# Altium schematic sheet External SDRAM.SchDoc: Ornihopter Kamera Kartı
size A4; CompanyName: Erü EEM; Engineer: Berat Bayram; Address1: https://www.linkedin.com/in/beratbayram-eee/; DocumentNumber: OKK_1; Revision: V1; SheetNumber: 2; SheetTotal: 5
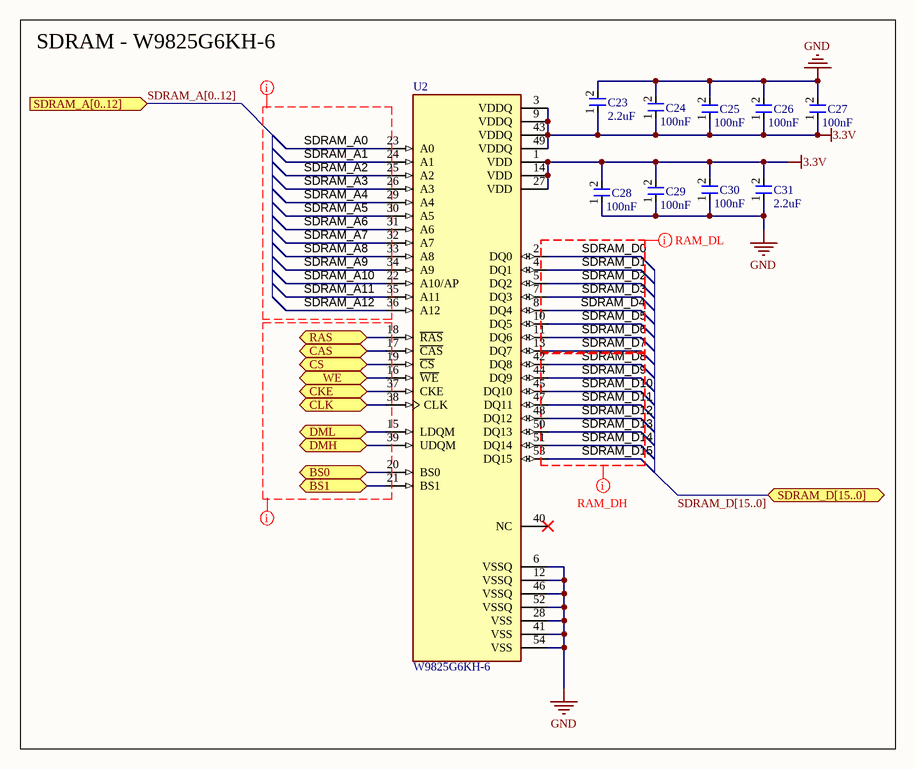
[diagram p0: External SDRAM.SchDoc]

## Parts
C23  C: 2.2uF  [0603 Cap]  (hidden comment: 0603)
C24  C: 100nF  [0603 Cap]  (hidden comment: 0603)
C25  C: 100nF  [0603 Cap]  (hidden comment: 0603)
C26  C: 100nF  [0603 Cap]  (hidden comment: 0603)
C27  C: 100nF  [0603 Cap]  (hidden comment: 0603)
C28  C: 100nF  [0603 Cap]  (hidden comment: 0603)
C29  C: 100nF  [0603 Cap]  (hidden comment: 0603)
C30  C: 100nF  [0603 Cap]  (hidden comment: 0603)
C31  C: 2.2uF  [0603 Cap]  (hidden comment: 0603)
U2  W9825G6KH-6  [SOP80P1176X120-54N]

## Blocks framed on the sheet
SDRAM - W9825G6KH-6: C23-C31 U2

## Ports
BS0 (bidir, see STM32H743 MCU[6B]), BS1 (bidir, see STM32H743 MCU[6B]), CAS (bidir, see STM32H743 MCU[6C]), CKE (bidir, see STM32H743 MCU[4C]), CLK (bidir, see STM32H743 MCU[6C]), CS (bidir, see STM32H743 MCU[4C]), DMH (bidir, see STM32H743 MCU[4B]), DML (bidir, see STM32H743 MCU[4B]), RAS (bidir, see STM32H743 MCU[2C]), SDRAM_A[0..12] (in, see STM32H743 MCU[5A]), SDRAM_D[15..0] (bidir, see STM32H743 MCU[7B]), WE (bidir, see STM32H743 MCU[2C])

## Nets
3.3V: C23.1 C24.1 C25.1 C26.1 C27.1 C28.2 C29.2 C30.2 C31.2 U2.1(VDD) U2.3(VDDQ) U2.9(VDDQ) U2.14(VDD) U2.27(VDD) U2.43(VDDQ) U2.49(VDDQ)
GND: C23.2 C24.2 C25.2 C26.2 C27.2 C28.1 C29.1 C30.1 C31.1 U2.6(VSSQ) U2.12(VSSQ) U2.28(VSS) U2.41(VSS) U2.46(VSSQ) U2.52(VSSQ) U2.54(VSS)
BS0: U2.20(BS0) ; port BS0
BS1: U2.21(BS1) ; port BS1
CAS: U2.17(~{CAS}) ; port CAS
CKE: U2.37(CKE) ; port CKE
CLK: U2.38(CLK) ; port CLK
CS: U2.19(~{CS}) ; port CS
DMH: U2.39(UDQM) ; port DMH
DML: U2.15(LDQM) ; port DML
RAS: U2.18(~{RAS}) ; port RAS
SDRAM_A0: U2.23(A0)
SDRAM_A1: U2.24(A1)
SDRAM_A2: U2.25(A2)
SDRAM_A3: U2.26(A3)
SDRAM_A4: U2.29(A4)
SDRAM_A5: U2.30(A5)
SDRAM_A6: U2.31(A6)
SDRAM_A7: U2.32(A7)
SDRAM_A8: U2.33(A8)
SDRAM_A9: U2.34(A9)
SDRAM_A10: U2.22(A10/AP)
SDRAM_A11: U2.35(A11)
SDRAM_A12: U2.36(A12)
SDRAM_D0: U2.2(DQ0)
SDRAM_D1: U2.4(DQ1)
SDRAM_D2: U2.5(DQ2)
SDRAM_D3: U2.7(DQ3)
SDRAM_D4: U2.8(DQ4)
SDRAM_D5: U2.10(DQ5)
SDRAM_D6: U2.11(DQ6)
SDRAM_D7: U2.13(DQ7)
SDRAM_D8: U2.42(DQ8)
SDRAM_D9: U2.44(DQ9)
SDRAM_D10: U2.45(DQ10)
SDRAM_D11: U2.47(DQ11)
SDRAM_D12: U2.48(DQ12)
SDRAM_D13: U2.50(DQ13)
SDRAM_D14: U2.51(DQ14)
SDRAM_D15: U2.53(DQ15)
WE: U2.16(~{WE}) ; port WE

Not connected (* = marked no-connect by the designer): U2 40(NC)*

## Buses and harness runs
bus SDRAM_A[0..12] = port SDRAM_A[0..12]
bus SDRAM_D[15..0] = port SDRAM_D[15..0]

## Layout directives
net class RAM_DH: SDRAM_D8, SDRAM_D9, SDRAM_D10, SDRAM_D11, SDRAM_D12, SDRAM_D13, SDRAM_D14, SDRAM_D15
net class RAM_DL: SDRAM_D0, SDRAM_D1, SDRAM_D2, SDRAM_D3, SDRAM_D4, SDRAM_D5, SDRAM_D6, SDRAM_D7
net class SD_Add: SDRAM_A0, SDRAM_A1, SDRAM_A2, SDRAM_A3, SDRAM_A4, SDRAM_A5, SDRAM_A6, SDRAM_A7, SDRAM_A8, SDRAM_A9, SDRAM_A10, SDRAM_A11, SDRAM_A12
net class SD_Pins: (no net found under the mark)

## Notes on the sheet
- Title:
- Enigneer:
- Page Contents:
- Company:
- Size:
- Date:
- File:
- Website:
- A4
- Number:
- Time:
- Revision:
- Sheet

## Library data of the parts
C23-C31 = 0603 Cap
U2 = W9825G6KH-6: SDRAM Memory IC 256Mb (16M x 16) Parallel 166MHz 5ns 54-TSOP II; MF: {'manufacturer': u'Winbond Electronics'}; Package: None; MP: W9825G6KH-6; Availability: Unavailable; Price: None